# Altium schematic sheet Scheme_Indication.SchDoc
size 420 x 297 mm; Address1: Address1; Address2: Address2; Address3: Address3; Address4: Address4; DocumentNumber: 2; SheetNumber: 2; Scale: 1:1; DocumentType: Схема электрическая принципиальная; FirstReferrence: АБВГ.123456.001
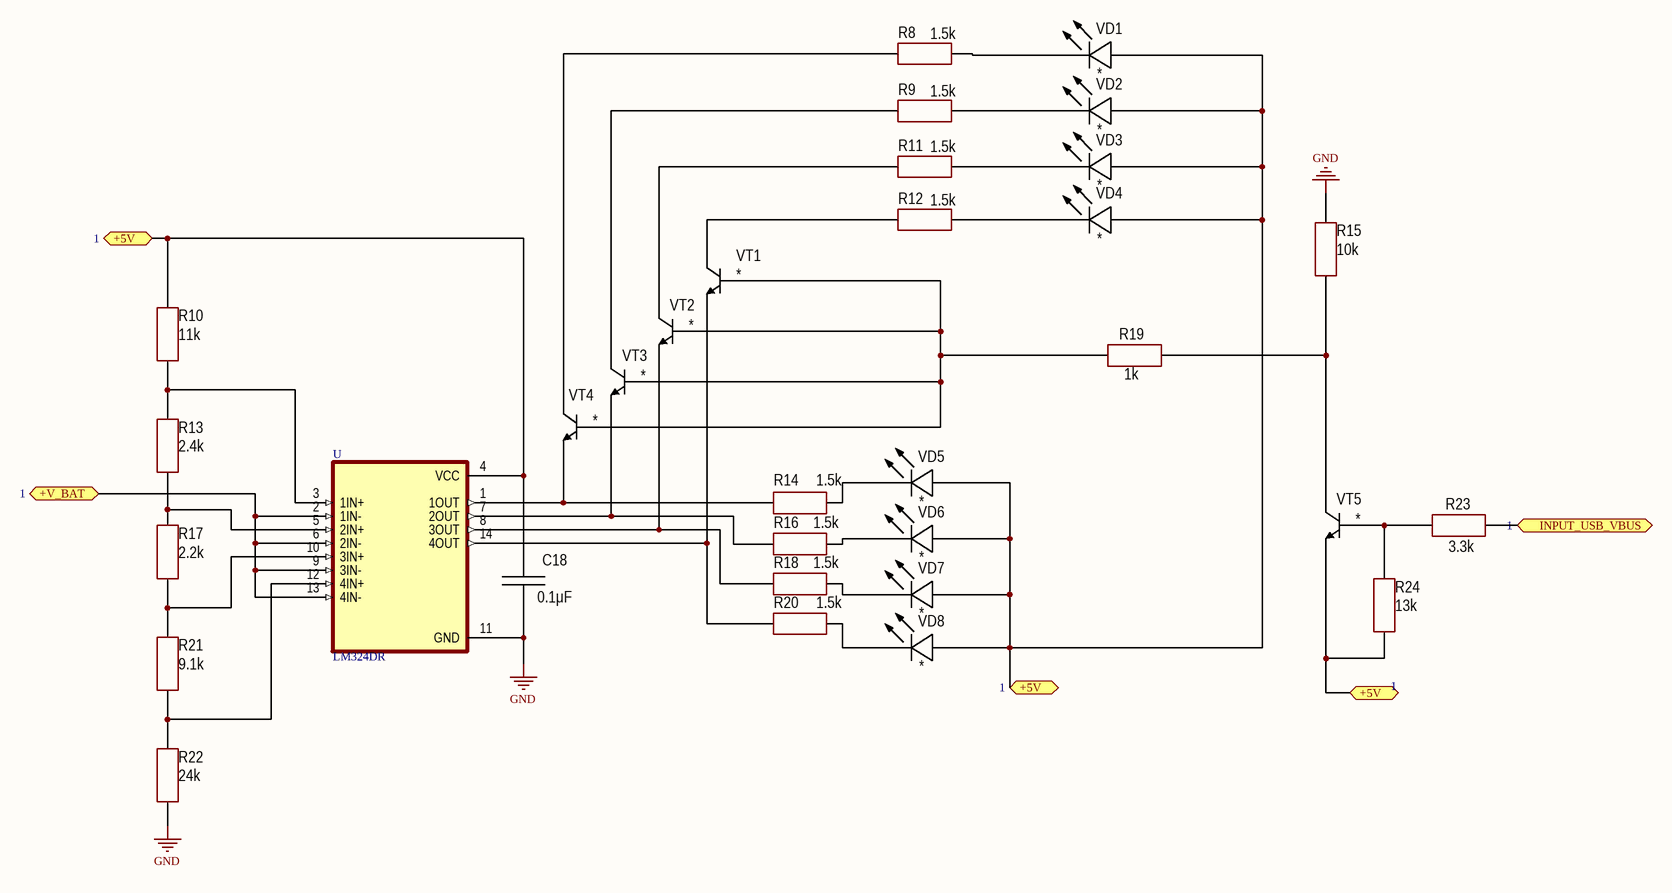
[diagram p0: Scheme_Indication.SchDoc]

## Parts
C18  value 0.1μF  [CAP: 1206]
R8  value 1.5k  [RES: 1206]
R9  value 1.5k  [RES: 1206]
R10  value 11k  [RES: 1206]
R11  value 1.5k  [RES: 1206]
R12  value 1.5k  [RES: 1206]
R13  value 2.4k  [RES: 1206]
R14  value 1.5k  [RES: 1206]
R15  value 10k  [RES: 1206]
R16  value 1.5k  [RES: 1206]
R17  value 2.2k  [RES: 1206]
R18  value 1.5k  [RES: 1206]
R19  value 1k  [RES: 1206]
R20  value 1.5k  [RES: 1206]
R21  value 9.1k  [RES: 1206]
R22  value 24k  [RES: 1206]
R23  value 3.3k  [RES: 1206]
R24  value 13k  [RES: 1206]
U  LM324DR  [SOIC127P600X175-14N]
VD1  *  [CH1206LY]
VD2  *  [CH1206LY]
VD3  *  [CH1206LY]
VD4  *  [CH1206LY]
VD5  *  [CH1206LY]
VD6  *  [CH1206LY]
VD7  *  [CH1206LY]
VD8  *  [CH1206LY]
VT1  *  [SOT23_123]
VT2  *  [SOT23_123]
VT3  *  [SOT23_123]
VT4  *  [SOT23_123]
VT5  *  [SOT23_123]

## Ports
+5V (see 1), +V_BAT (see 1), INPUT_USB_VBUS (see 1)

## Nets
GND: C18.1 R15.1 R22.1 U.11(GND)
+5V: C18.2 R10.2 R24.2 U.4(VCC) VD1.1(A) VD2.1(A) VD3.1(A) VD4.1(A) VD5.1(A) VD6.1(A) VD7.1(A) VD8.1(A) VT5.3(E) ; port +5V
+V_BAT: U.2(1IN-) U.6(2IN-) U.9(3IN-) U.13(4IN-) ; port +V_BAT
INPUT_USB_VBUS: R23.2 ; port INPUT_USB_VBUS
NetR8_1: R8.1 VT4.2(C)
NetR8_2: R8.2 VD1.2(C)
NetR9_1: R9.1 VT3.2(C)
NetR9_2: R9.2 VD2.2(C)
NetR10_1: R10.1 R13.2 U.3(1IN+)
NetR11_1: R11.1 VT2.2(C)
NetR11_2: R11.2 VD3.2(C)
NetR12_1: R12.1 VT1.2(C)
NetR12_2: R12.2 VD4.2(C)
NetR13_1: R13.1 R17.2 U.5(2IN+)
NetR14_1: R14.1 U.1(1OUT) VT4.3(E)
NetR14_2: R14.2 VD5.2(C)
NetR15_2: R15.2 R19.2 VT5.2(C)
NetR16_1: R16.1 U.7(2OUT) VT3.3(E)
NetR16_2: R16.2 VD6.2(C)
NetR17_1: R17.1 R21.2 U.10(3IN+)
NetR18_1: R18.1 U.8(3OUT) VT2.3(E)
NetR18_2: R18.2 VD7.2(C)
NetR19_1: R19.1 VT1.1(B) VT2.1(B) VT3.1(B) VT4.1(B)
NetR20_1: R20.1 U.14(4OUT) VT1.3(E)
NetR20_2: R20.2 VD8.2(C)
NetR21_1: R21.1 R22.2 U.12(4IN+)
NetR23_1: R23.1 R24.1 VT5.1(B)

## Notes on the sheet
- Перв. примен.
- Справ. №
- Подп. и дата
- Инв. № дубл.
- Взам. инв. №
- Разраб.
- Изм.
- Лист
- № докум.
- Подп.
- Дата
- Лит.
- Масса
- Масштаб
- Пров.
- Т.контр.
- Листов
- Инв. № подл.
- Утв.
- Н.контр.
- 2.106-A3
- Копировал
- Формат А3

## Library data of the parts
C18 = Ceramic_1206: Manufacturer: Yageo; PartNumber: CC1206KRX7R9BB104; ValueManufacturerPartNumber: Ceramic capacitor, 0.1μF, X7R, ±10%, 50V, 1206, -55...+125°C; TypeCapacitor: Ceramic capacitor; Tolerance: ±10%; TypeDielectric: X7R; Voltage: 50V; Package: 1206; HelpURL: https://www.digikey.com/product-detail/en/yageo/CC1206KRX7R9BB104/311-1179-1-ND/303089; Temperature: -55...+125°C
R8 R9 R11 R12 R14 R16 R18 R20 = Resistor_1206: Manufacturer: Yageo; PartNumber: RC1206JR-07100RL; ValueManufacturerPartNumber: Resistor film, 1.5k, ±5%, 1206, 0.25W, -55...+125°C; TypeResistor: Resistor film; Power: 0.25W; Tolerance: ±5%; Package: 1206; HelpURL: https://www.digikey.com/product-detail/en/yageo/RC1206JR-07100RL/311-100ERCT-ND/732153; Temperature: -55...+125°C
R10 = Resistor_1206: Manufacturer: Yageo; PartNumber: RC1206JR-07100RL; ValueManufacturerPartNumber: Resistor film, 11k, ±5%, 1206, 0.25W, -55...+125°C; TypeResistor: Resistor film; Power: 0.25W; Tolerance: ±5%; Package: 1206; HelpURL: https://www.digikey.com/product-detail/en/yageo/RC1206JR-07100RL/311-100ERCT-ND/732153; Temperature: -55...+125°C
R13 = Resistor_1206: Manufacturer: Yageo; PartNumber: RC1206JR-07100RL; ValueManufacturerPartNumber: Resistor film, 2.4k, ±5%, 1206, 0.25W, -55...+125°C; TypeResistor: Resistor film; Power: 0.25W; Tolerance: ±5%; Package: 1206; HelpURL: https://www.digikey.com/product-detail/en/yageo/RC1206JR-07100RL/311-100ERCT-ND/732153; Temperature: -55...+125°C
R15 = Resistor_1206: Manufacturer: Yageo; PartNumber: RC1206JR-07100RL; ValueManufacturerPartNumber: Resistor film, 10k, ±5%, 1206, 0.25W, -55...+125°C; TypeResistor: Resistor film; Power: 0.25W; Tolerance: ±5%; Package: 1206; HelpURL: https://www.digikey.com/product-detail/en/yageo/RC1206JR-07100RL/311-100ERCT-ND/732153; Temperature: -55...+125°C
R17 = Resistor_1206: Manufacturer: Yageo; PartNumber: RC1206JR-07100RL; ValueManufacturerPartNumber: Resistor film, 2.2k, ±5%, 1206, 0.25W, -55...+125°C; TypeResistor: Resistor film; Power: 0.25W; Tolerance: ±5%; Package: 1206; HelpURL: https://www.digikey.com/product-detail/en/yageo/RC1206JR-07100RL/311-100ERCT-ND/732153; Temperature: -55...+125°C
R19 = Resistor_1206: Manufacturer: Yageo; PartNumber: RC1206JR-07100RL; ValueManufacturerPartNumber: Resistor film, 1k, ±5%, 1206, 0.25W, -55...+125°C; TypeResistor: Resistor film; Power: 0.25W; Tolerance: ±5%; Package: 1206; HelpURL: https://www.digikey.com/product-detail/en/yageo/RC1206JR-07100RL/311-100ERCT-ND/732153; Temperature: -55...+125°C
R21 = Resistor_1206: Manufacturer: Yageo; PartNumber: RC1206JR-07100RL; ValueManufacturerPartNumber: Resistor film, 9.1k, ±5%, 1206, 0.25W, -55...+125°C; TypeResistor: Resistor film; Power: 0.25W; Tolerance: ±5%; Package: 1206; HelpURL: https://www.digikey.com/product-detail/en/yageo/RC1206JR-07100RL/311-100ERCT-ND/732153; Temperature: -55...+125°C
R22 = Resistor_1206: Manufacturer: Yageo; PartNumber: RC1206JR-07100RL; ValueManufacturerPartNumber: Resistor film, 24k, ±5%, 1206, 0.25W, -55...+125°C; TypeResistor: Resistor film; Power: 0.25W; Tolerance: ±5%; Package: 1206; HelpURL: https://www.digikey.com/product-detail/en/yageo/RC1206JR-07100RL/311-100ERCT-ND/732153; Temperature: -55...+125°C
R23 = Resistor_1206: Manufacturer: Yageo; PartNumber: RC1206JR-07100RL; ValueManufacturerPartNumber: Resistor film, 3.3k, ±5%, 1206, 0.25W, -55...+125°C; TypeResistor: Resistor film; Power: 0.25W; Tolerance: ±5%; Package: 1206; HelpURL: https://www.digikey.com/product-detail/en/yageo/RC1206JR-07100RL/311-100ERCT-ND/732153; Temperature: -55...+125°C
R24 = Resistor_1206: Manufacturer: Yageo; PartNumber: RC1206JR-07100RL; ValueManufacturerPartNumber: Resistor film, 13k, ±5%, 1206, 0.25W, -55...+125°C; TypeResistor: Resistor film; Power: 0.25W; Tolerance: ±5%; Package: 1206; HelpURL: https://www.digikey.com/product-detail/en/yageo/RC1206JR-07100RL/311-100ERCT-ND/732153; Temperature: -55...+125°C
U = LM324DR: 4-Channel industry standard operational amplifier 14-SOIC 0 to 70; MF: Texas Instruments; SnapEDA_Link: https://www.snapeda.com/parts/LM324DR/Texas%20Instruments/view-part/1818/?ref=snap; Arrow_Electronics-Purchase-URL: https://snapeda.com/shop?store=Arrow+Electronics&id=1818; Value: *; MP: LM324DR; Availability: Good; Texas_Instruments-Purchase-URL: https://snapeda.com/shop?store=Texas+Instruments&id=1818; DigiKey-Purchase-URL: https://snapeda.com/shop?store=DigiKey&id=1818; Package: SOIC-14 Texas Instruments; Mouser-Purchase-URL: https://snapeda.com/shop?store=Mouser&id=1818; Price: None
VD1-VD8 = LED: Manufacturer: *; Model: *; HelpURL: *; ComponentKind: *; Value: *
VT1-VT5 = NPN: Bipolar; Model: *; Manufacturer: *; ComponentKind: *; HelpURL: *